# Altium project Passive_Sonar_Rev1.PrjPcb
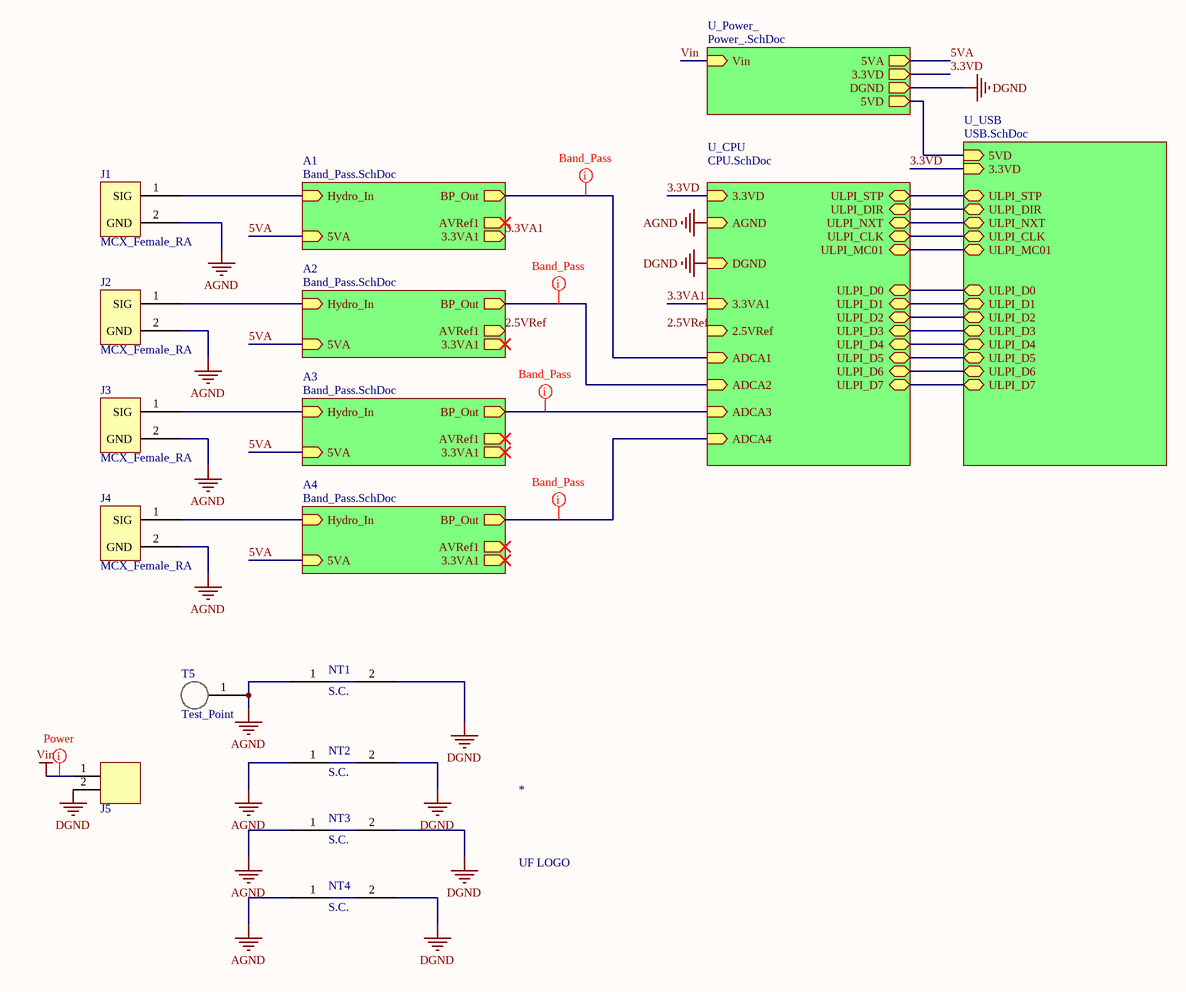
[diagram p0: Top_Level.SchDoc]
5 sheets, 222 parts. Net scope: hierarchical (ports join the sheet entries above them; power ports are global).
Board file: Passive_Sonar_Rev1.PcbDoc
Sheets:
  Top_Level.SchDoc
    A1 = Band_Pass.SchDoc
    A2 = Band_Pass.SchDoc
    A3 = Band_Pass.SchDoc
    A4 = Band_Pass.SchDoc
    U_Power_ = Power_.SchDoc
    U_CPU = CPU.SchDoc
    U_USB = USB.SchDoc

## Sheet Top_Level.SchDoc
size 381 x 381 mm

### Parts
*  UF LOGO  [UF LOGO-1000]
J1  MCX_Female_RA  [MCX_Female]
J2  MCX_Female_RA  [MCX_Female]
J3  MCX_Female_RA  [MCX_Female]
J4  MCX_Female_RA  [MCX_Female]
J5  2-pin Horz Sherlock  [MOLEX-HDR-1X2-SHERLOCK-HORZ]  (value not drawn)
MIL  MIL LOGO  [MIL LOGO - 500]  (value not drawn)
NT1  S.C.  [Net_Tie]
NT2  S.C.  [Net_Tie]
NT3  S.C.  [Net_Tie]
NT4  S.C.  [Net_Tie]
T5  Test_Point  [TP]

### Sub-sheets
A1 = Band_Pass.SchDoc: Hydro_In (in), BP_Out (out), 5VA (in), 3.3VA1 (out), AVRef1 (out)
A2 = Band_Pass.SchDoc: Hydro_In (in), BP_Out (out), 5VA (in), AVRef1 (out), 3.3VA1 (out)
A3 = Band_Pass.SchDoc: Hydro_In (in), BP_Out (out), 5VA (in), AVRef1 (out), 3.3VA1 (out)
A4 = Band_Pass.SchDoc: Hydro_In (in), BP_Out (out), 5VA (in), AVRef1 (out), 3.3VA1 (out)
U_CPU = CPU.SchDoc: 3.3VD (in), AGND (in), DGND (in), 3.3VA1 (in), 2.5VRef (in), ADCA1 (in), ADCA2 (in), ADCA3 (in), ADCA4 (in), ULPI_STP (bidir), ULPI_DIR (bidir), ULPI_NXT (bidir), ULPI_D0 (bidir), ULPI_D1 (bidir), ULPI_CLK (bidir), ULPI_D2 (bidir), ULPI_D3 (bidir), ULPI_D4 (bidir), ULPI_D5 (bidir), ULPI_D6 (bidir), ULPI_D7 (bidir), ULPI_MC01 (bidir)
U_Power_ = Power_.SchDoc: 5VA (out), Vin (in), 3.3VD (out), DGND (out), 5VD (out)
U_USB = USB.SchDoc: 5VD (in), 3.3VD (in), ULPI_STP (bidir), ULPI_DIR (bidir), ULPI_NXT (bidir), ULPI_D0 (bidir), ULPI_D1 (bidir), ULPI_CLK (bidir), ULPI_D2 (bidir), ULPI_D3 (bidir), ULPI_D4 (bidir), ULPI_D5 (bidir), ULPI_D6 (bidir), ULPI_MC01 (bidir), ULPI_D7 (bidir)

### Nets
3.3VA1: sheet A1/3.3VA1, sheet A2/3.3VA1, sheet A3/3.3VA1, sheet A4/3.3VA1, sheet U_CPU/3.3VA1
3.3VD: sheet U_Power_/3.3VD, sheet U_CPU/3.3VD, sheet U_USB/3.3VD
5VA: sheet A1/5VA, sheet A2/5VA, sheet A3/5VA, sheet A4/5VA, sheet U_Power_/5VA
5VD: sheet U_Power_/5VD, sheet U_USB/5VD
AGND: J1.2(GND) J2.2(GND) J3.2(GND) J4.2(GND) NT1.1 NT2.1 NT3.1 NT4.1 T5.1 ; sheet U_CPU/AGND
DGND: J5.2 NT1.2 NT2.2 NT3.2 NT4.2 ; sheet U_Power_/DGND, sheet U_CPU/DGND
Vin: J5.1 ; sheet U_Power_/Vin
Hydro1: J1.1(SIG) ; sheet A1/Hydro_In
Hydro1: J2.1(SIG) ; sheet A2/Hydro_In  [a separate net that carries the same name]
Hydro1: J3.1(SIG) ; sheet A3/Hydro_In  [a separate net that carries the same name]
Hydro1: J4.1(SIG) ; sheet A4/Hydro_In  [a separate net that carries the same name]
NetU2_A1_6: sheet A1/BP_Out, sheet U_CPU/ADCA1
NetU2_A2_6: sheet A2/BP_Out, sheet U_CPU/ADCA2
NetU2_A3_6: sheet A3/BP_Out, sheet U_CPU/ADCA3
NetU2_A4_6: sheet A4/BP_Out, sheet U_CPU/ADCA4
NetU8_26: sheet U_CPU/ULPI_STP, sheet U_USB/ULPI_STP
NetU8_28: sheet U_CPU/ULPI_DIR, sheet U_USB/ULPI_DIR
NetU8_29: sheet U_CPU/ULPI_NXT, sheet U_USB/ULPI_NXT
NetU8_37: sheet U_CPU/ULPI_D0, sheet U_USB/ULPI_D0
NetU8_41: sheet U_CPU/ULPI_CLK, sheet U_USB/ULPI_CLK
NetU8_46: sheet U_CPU/ULPI_D1, sheet U_USB/ULPI_D1
NetU8_47: sheet U_CPU/ULPI_D2, sheet U_USB/ULPI_D2
NetU8_69: sheet U_CPU/ULPI_D3, sheet U_USB/ULPI_D3
NetU8_70: sheet U_CPU/ULPI_D4, sheet U_USB/ULPI_D4
NetU8_73: sheet U_CPU/ULPI_D5, sheet U_USB/ULPI_D5
NetU8_74: sheet U_CPU/ULPI_D6, sheet U_USB/ULPI_D6
NetU8_100: sheet U_CPU/ULPI_MC01, sheet U_USB/ULPI_MC01
NetU8_135: sheet U_CPU/ULPI_D7, sheet U_USB/ULPI_D7

### Layout directives
net class Power: Vin
net class Band_Pass: NetU2_A1_6, NetU2_A2_6, NetU2_A3_6, NetU2_A4_6

### Notes on the sheet
- Labels drawn without touching a wire or pin: 2.5VRef

### Library data of the parts
J1-J4 = MCX_Female_RA: CONN MCX JACK R/A 50 OHM PCB; Supplier 1: Digi-Key; Supplier Part Number 1: A98546-ND
J5 = MOLEX-HDR-1x2-SHERLOCK_RA: Header, Molex, 2mm Pitch Sherlock Header, Single Row, Horizontal, 2 Circuits, Length 3.3mm,  0353630260; Manufacturer: Molex Inc; Manufacturer Part Number: 0353630260; Supplier Part Number 1: WM18931-ND; Supplier 1: Digi-Key
NT1-NT4 = Net_Tie
T5 = Test_Point: TEST POINT PC COMPACT .063"D; Supplier 1: Digi-Key; Supplier Part Number 1: 5006K-ND

## Sheet Band_Pass.SchDoc
size 381 x 254 mm
Used 4 times, as channels A1, A2, A3, A4. Parts and nets are listed once, with the designators drawn on the sheet.
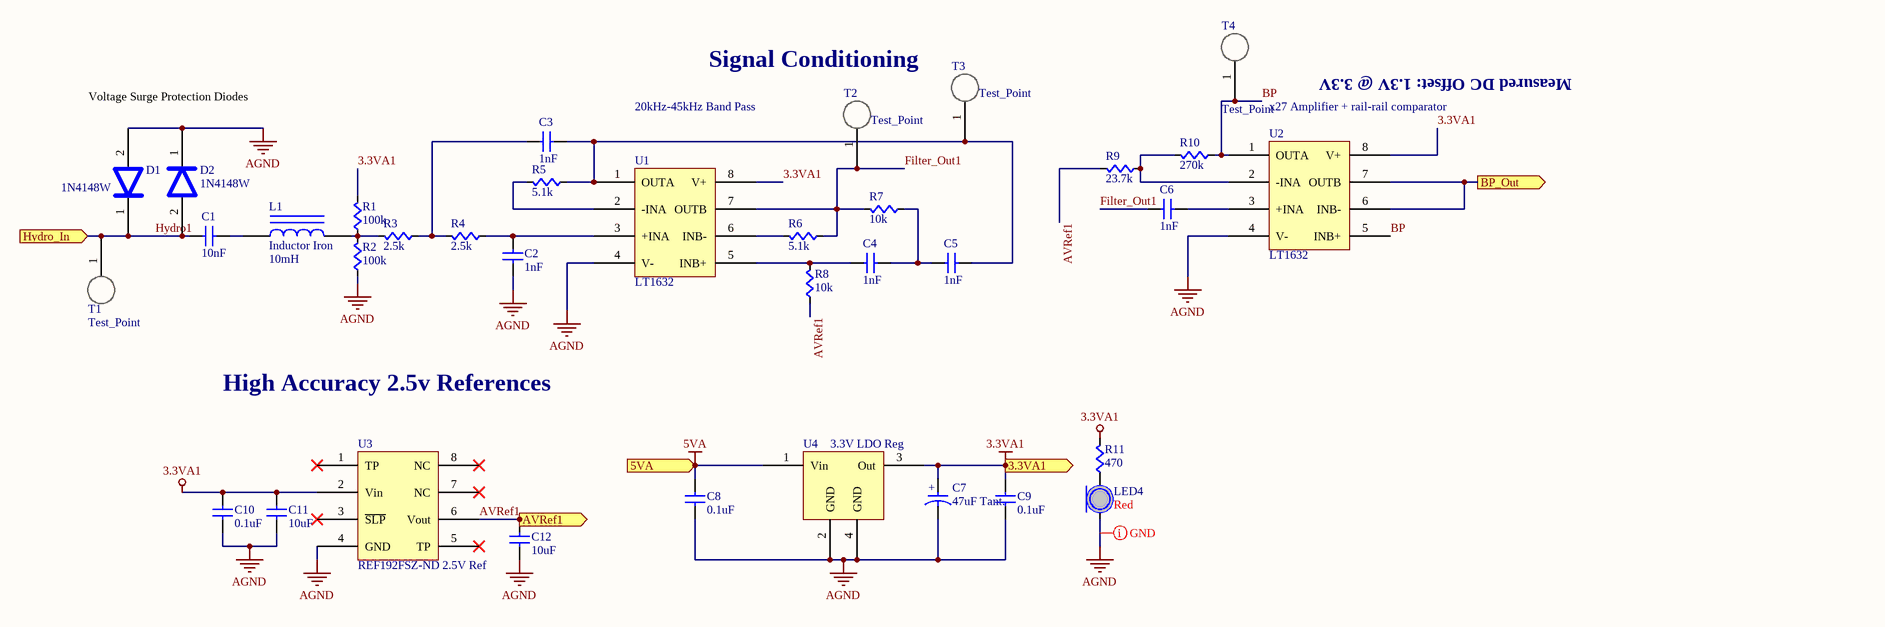
[diagram p1: Band_Pass.SchDoc]

### Parts
C1  value 10nF  [CAPC0603]  (hidden comment: Cap)
C2  value 1nF  [CAPC0603]  (hidden comment: Cap)
C3  value 1nF  [CAPC0603]  (hidden comment: Cap)
C4  value 1nF  [CAPC0603]  (hidden comment: Cap)
C5  value 1nF  [CAPC0603]  (hidden comment: Cap)
C6  value 1nF  [CAPC0603]  (hidden comment: Cap)
C7  value 47uF Tant.  [1206]  (hidden comment: Cap Tant)
C8  value 0.1uF  [CAPC0603]  (hidden comment: Cap)
C9  value 0.1uF  [CAPC0603]  (hidden comment: Cap)
C10  value 0.1uF  [CAPC0603]  (hidden comment: Cap)
C11  value 10uF  [CAPC0603]  (hidden comment: Cap)
C12  value 10uF  [CAPC0603]  (hidden comment: Cap)
D1  1N4148W  [SOD-123]
D2  1N4148W  [SOD-123]
L1  Inductor Iron  value 10mH  [Axial-11.7]
LED4  Color: Red  [LED0805]  (hidden comment: LED)
R1  value 100k  [RES0603]  (hidden comment: Res)
R2  value 100k  [RES0603]  (hidden comment: Res)
R3  value 2.5k  [RES0603]  (hidden comment: Res)
R4  value 2.5k  [RES0603]  (hidden comment: Res)
R5  value 5.1k  [RES0603]  (hidden comment: Res)
R6  value 5.1k  [RES0603]  (hidden comment: Res)
R7  value 10k  [RES0603]  (hidden comment: Res)
R8  value 10k  [RES0603]  (hidden comment: Res)
R9  value 23.7k  [RES0603]  (hidden comment: Res)
R10  value 270k  [RES0603]  (hidden comment: Res)
R11  value 470  [RES0603]  (hidden comment: Res)
T1  Test_Point  [TP]
T2  Test_Point  [TP]
T3  Test_Point  [TP]
T4  Test_Point  [TP]
U1  LT1632  [SOIC127P600-8N]
U2  LT1632  [SOIC127P600-8N]
U3  REF192FSZ-ND 2.5V Ref  [SOIC2.5-8n]
U4  3.3V LDO Reg  [SOT23-4n]

### Ports
3.3VA1 (out), 5VA (in), AVRef1 (out), BP_Out (out), Hydro_In (in)

### Nets
3.3VA1: C7.1(A) C9.1(A) C10.1(A) C11.1(A) R1.1(A) R11.1(A) U1.8(V+) U2.8(V+) U3.2(Vin) U4.3(Out) ; port 3.3VA1
5VA: C8.1(A) U4.1(Vin) ; port 5VA
AGND: C2.2(B) C7.2(B) C8.2(B) C9.2(B) C10.2(B) C11.2(B) C12.2(B) D1.2 D2.1 LED4.C R2.2(B) U1.4(V-) U2.4(V-) U3.4(GND) U4.2(GND) U4.4(GND)
AVRef1: C12.1(A) R8.2(B) R9.1(A) U3.6(Vout) ; port AVRef1
BP: R10.2(B) T4.1 U2.1(OUTA) U2.5(INB+)
BP_Out: U2.6(INB-) U2.7(OUTB) ; port BP_Out
Filter_Out1: C6.1(A) R6.2(B) R7.1(A) T2.1 U1.7(OUTB)
Hydro1: C1.1(A) D1.1 D2.2 T1.1 ; port Hydro_In
NetC1_2: C1.2(B) L1.1
NetC2_1: C2.1(A) R4.2(B) U1.3(+INA)
NetC3_1: C3.1(A) R3.2(B) R4.1(A)
NetC3_2: C3.2(B) C5.2(B) R5.2(B) T3.1 U1.1(OUTA)
NetC4_1: C4.1(A) R8.1(A) U1.5(INB+)
NetC4_2: C4.2(B) C5.1(A) R7.2(B)
NetC6_2: C6.2(B) U2.3(+INA)
NetL1_2: L1.2 R1.2(B) R2.1(A) R3.1(A)
NetLED4_A: LED4.A R11.2(B)
NetR5_1: R5.1(A) U1.2(-INA)
NetR6_1: R6.1(A) U1.6(INB-)
NetR9_2: R9.2(B) R10.1(A) U2.2(-INA)

Not connected (* = marked no-connect by the designer): U3 1(TP)* 3(~{SLP})* 5(TP)* 7(NC)* 8(NC)*

### Channels
A1: designators end in _A1; ports 3.3VA1=3.3VA1 5VA=5VA AVRef1=AVRef1_A1 BP_Out=NetU2_A1_6 Hydro_In=Hydro1
A2: designators end in _A2; ports 3.3VA1=3.3VA1 5VA=5VA AVRef1=2.5VRef BP_Out=NetU2_A2_6 Hydro_In=Hydro1
A3: designators end in _A3; ports 3.3VA1=3.3VA1 5VA=5VA AVRef1=AVRef1_A3 BP_Out=NetU2_A3_6 Hydro_In=Hydro1
A4: designators end in _A4; ports 3.3VA1=3.3VA1 5VA=5VA AVRef1=AVRef1_A4 BP_Out=NetU2_A4_6 Hydro_In=Hydro1

### Layout directives
net class Ground: AGND

### Notes on the sheet
- Voltage Surge Protection Diodes
- 20kHz-45kHz Band Pass
- Signal Conditioning
- x27 Amplifier + rail-rail comparator
- Measured DC Offset: 1.3V @ 3.3V
- High Accuracy 2.5v References
- (in symbol CapPol) +

### Library data of the parts
C7 = CapPol: CAP TANT 47UF 10V 10% 1411; Supplier 1: Digi-Key; Supplier Part Number 1: 399-9728-1-ND
D1 D2 = 1N4148W: DIODE GEN PURP 75V 150MA SOD123; Supplier 1: Digi-Key; Supplier Part Number 1: 1N4148W-E3-08CT-ND
L1 = Inductor Iron: Magnetic-Core Inductor; Published: 24-Mar-1999; LatestRevisionDate: 17-Jul-2002; LatestRevisionNote: Re-released for DXP Platform.; PackageReference: AXIAL-0.9; Publisher: Altium Limited; PackageDescription: Axial Device, Thru-Hole; 2 Leads; 0.9 in Pin Spacing; Supplier 1: Digi-Key; Supplier Part Number 1: RLB0812-103KL-ND
T1-T4 = Test_Point: TEST POINT PC COMPACT .063"D; Supplier 1: Digi-Key; Supplier Part Number 1: 5006K-ND
U1 U2 = LT1632: IC OPAMP GP 45MHZ RRO 8SO; Supplier 1: Digi-Key; Supplier Part Number 1: LT1632CS8#PBF-ND
U3 = Ref2.5V: IC VREF SERIES 2.5V 8SOIC; Supplier 1: Digi-Key; Supplier Part Number 1: REF192FSZ-ND
U4 = LM3940IMPX-3.3: IC REG LDO 3.3V 1A SOT223; Supplier 1: Digi-Key; Supplier Part Number 1: LM3940IMPX-3.3/NOPBCT-ND
C1-C6 C8-C12 = Cap: Supplier 1: Digi-Key; Supplier Part Number 1: 1276-1000-1-ND
LED4 = LED: Supplier 1: Digi-Key; Supplier Part Number 1: 754-1122-1-ND
R1-R11 = Res: Supplier 1: Digi-Key; Supplier Part Number 1: RMCF0603JT10K0CT-ND

## Sheet Power_.SchDoc
size 381 x 241 mm
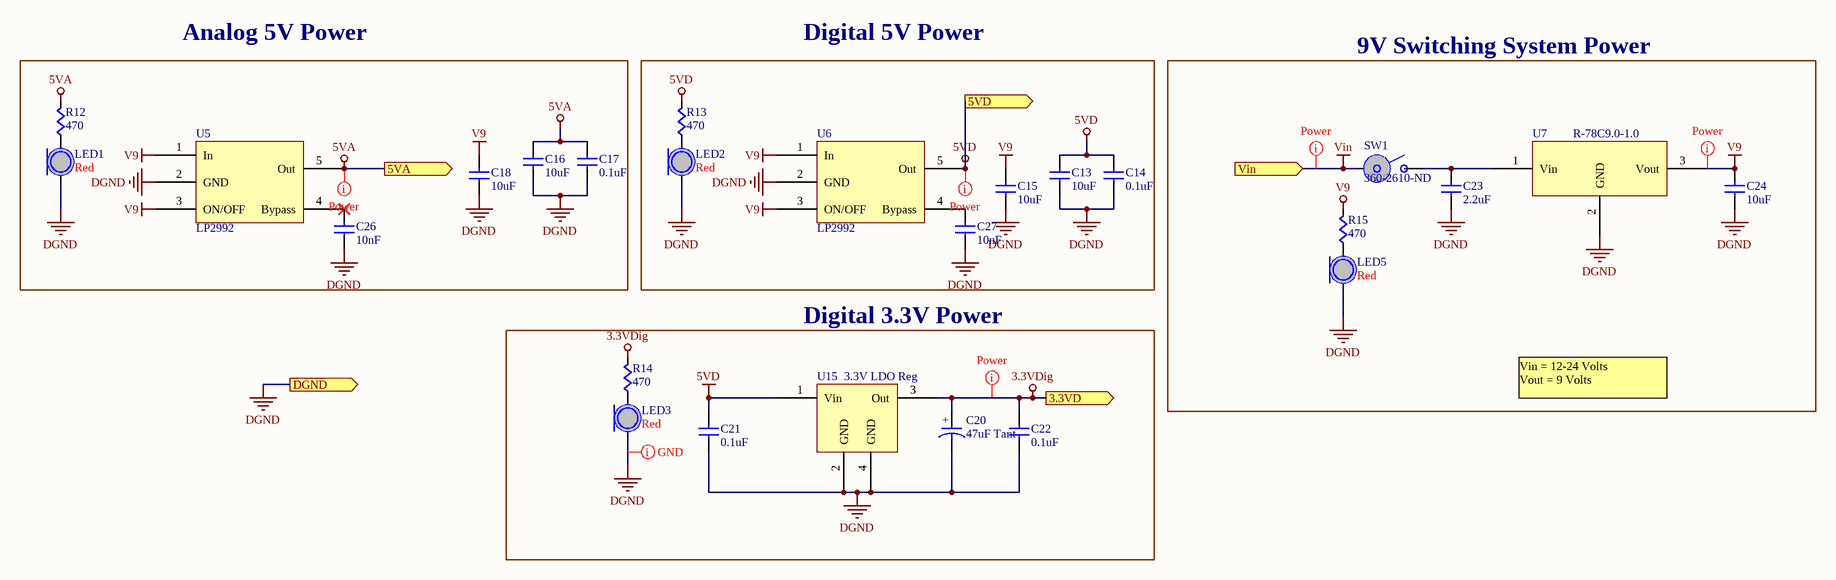
[diagram p2: Power_.SchDoc]

### Parts
C13  value 10uF  [CAPC0603]  (hidden comment: Cap)
C14  value 0.1uF  [CAPC0603]  (hidden comment: Cap)
C15  value 10uF  [CAPC0603]  (hidden comment: Cap)
C16  value 10uF  [CAPC0603]  (hidden comment: Cap)
C17  value 0.1uF  [CAPC0603]  (hidden comment: Cap)
C18  value 10uF  [CAPC0603]  (hidden comment: Cap)
C20  value 47uF Tant  [1206]  (hidden comment: Cap Tant)
C21  value 0.1uF  [CAPC0603]  (hidden comment: Cap)
C22  value 0.1uF  [CAPC0603]  (hidden comment: Cap)
C23  value 2.2uF  [CAPC0603]  (hidden comment: Cap)
C24  value 10uF  [CAPC0603]  (hidden comment: Cap)
C26  value 10nF  [CAPC0603]  (hidden comment: Cap)
C27  value 10nF  [CAPC0603]  (hidden comment: Cap)
LED1  Color: Red  [LED0805]  (hidden comment: LED)
LED2  Color: Red  [LED0805]  (hidden comment: LED)
LED3  Color: Red  [LED0805]  (hidden comment: LED)
LED5  Color: Red  [LED0805]  (hidden comment: LED)
R12  value 470  [RES0603]  (hidden comment: Res)
R13  value 470  [RES0603]  (hidden comment: Res)
R14  value 470  [RES0603]  (hidden comment: Res)
R15  value 470  [RES0603]  (hidden comment: Res)
SW1  360-2610-ND  [AS11CP]
U5  LP2992  [SOT23-5]
U6  LP2992  [SOT23-5]
U7  R-78C9.0-1.0  [R-78C12-1.0]
U15  3.3V LDO Reg  [SOT23-4n]

### Blocks framed on the sheet
Analog 5V Power: C16-C18 C26 LED1 R12 U5
Digital 5V Power: C13-C15 C27 LED2 R13 U6
9V Switching System Power: C23 C24 LED5 R15 SW1 U7
Digital 3.3V Power: C20-C22 LED3 R14 U15

### Ports
3.3VD (out), 5VA (out), 5VD (out), DGND (out), Vin (in)

### Nets
3.3VDig: C20.1(A) C22.1(A) R14.1(A) U15.3(Out) ; port 3.3VD  [project net 3.3VD]
5VA: C16.1(A) C17.1(A) R12.1(A) U5.5(Out) ; port 5VA
5VD: C13.1(A) C14.1(A) C21.1(A) R13.1(A) U6.5(Out) U15.1(Vin) ; port 5VD
DGND: C13.2(B) C14.2(B) C15.2(B) C16.2(B) C17.2(B) C18.2(B) C20.2(B) C21.2(B) C22.2(B) C23.2(B) C24.2(B) C26.2(B) C27.2(B) LED1.C LED2.C LED3.C LED5.C U5.2(GND) U6.2(GND) U7.2(GND) U15.2(GND) U15.4(GND) ; port DGND
V9: C15.1(A) C18.1(A) C24.1(A) R15.1(A) U5.1(In) U5.3(ON/OFF) U6.1(In) U6.3(ON/OFF) U7.3(Vout)
Vin: SW1.1(A) ; port Vin
NetC23_1: C23.1(A) SW1.2(B) U7.1(Vin)
NetC26_1: C26.1(A) U5.4(Bypass)
NetC27_1: C27.1(A) U6.4(Bypass)
NetLED1_A: LED1.A R12.2(B)
NetLED2_A: LED2.A R13.2(B)
NetLED3_A: LED3.A R14.2(B)
NetLED5_A: LED5.A R15.2(B)

### Layout directives
net class Power: 3.3VD, 5VA, 5VD, V9, Vin
net class Ground: DGND

### Notes on the sheet
- Vin = 12-24 Volts
  Vout = 9 Volts
- (in symbol CapPol) +

### Library data of the parts
C20 = CapPol: CAP TANT 47UF 10V 10% 1411; Supplier 1: Digi-Key; Supplier Part Number 1: 399-9728-1-ND
SW1 = AS11CP: SWITCH SLIDE SPST 0.4VA 28V; Supplier 1: Digi-Key; Supplier Part Number 1: 360-2610-ND
U5 U6 = LP2992: IC REG LDO 5V 0.25A SOT23-5; Supplier 1: Digi-Key; Supplier Part Number 1: LP2992IM5-5.0/NOPBCT-ND
U7 = R-78C9-1.0: 945-1396-5-ND; Supplier 1: Digi-Key; Supplier Part Number 1: 945-1396-5-ND
U15 = LM3940IMPX-3.3: IC REG LDO 3.3V 1A SOT223; Supplier 1: Digi-Key; Supplier Part Number 1: LM3940IMPX-3.3/NOPBCT-ND
C13-C18 C21-C24 C26 C27 = Cap: Supplier 1: Digi-Key; Supplier Part Number 1: 1276-1000-1-ND
LED1-LED3 LED5 = LED: Supplier 1: Digi-Key; Supplier Part Number 1: 754-1122-1-ND
R12-R15 = Res: Supplier 1: Digi-Key; Supplier Part Number 1: RMCF0603JT10K0CT-ND

## Sheet CPU.SchDoc
size 381 x 381 mm
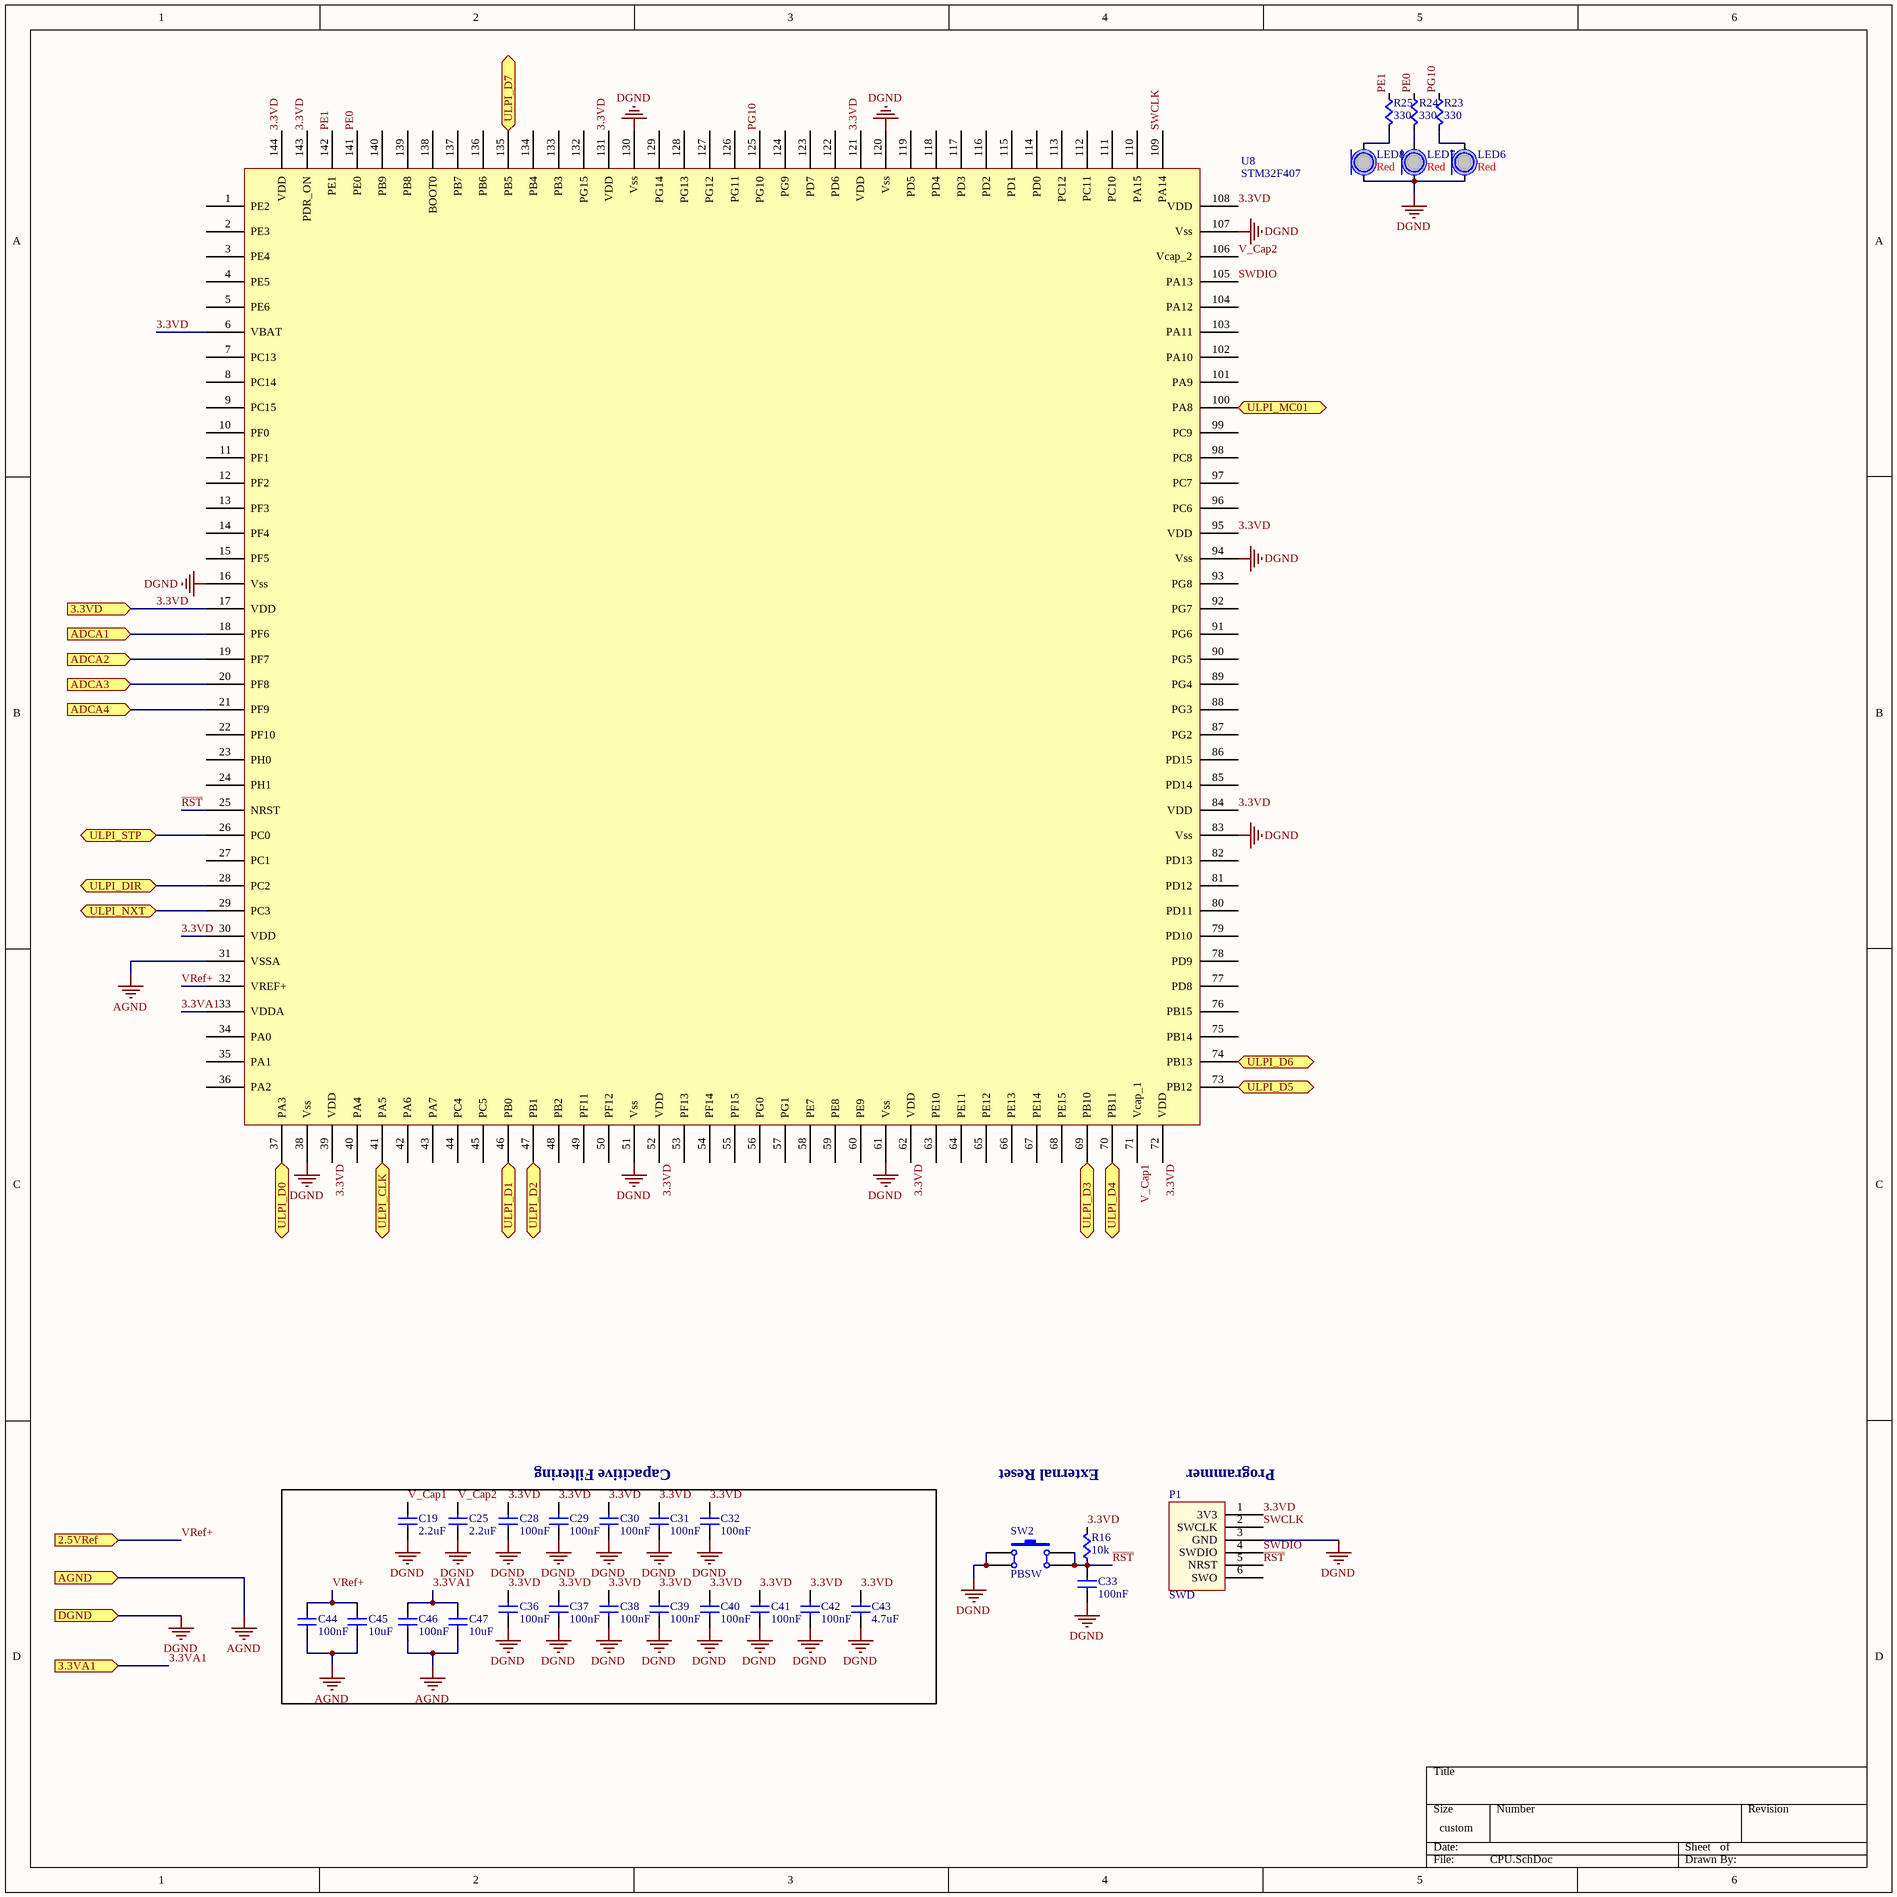
[diagram p3: CPU.SchDoc]

### Parts
C19  value 2.2uF  [CAPC0603]  (hidden comment: Cap)
C25  value 2.2uF  [CAPC0603]  (hidden comment: Cap)
C28  value 100nF  [CAPC0603]  (hidden comment: Cap)
C29  value 100nF  [CAPC0603]  (hidden comment: Cap)
C30  value 100nF  [CAPC0603]  (hidden comment: Cap)
C31  value 100nF  [CAPC0603]  (hidden comment: Cap)
C32  value 100nF  [CAPC0603]  (hidden comment: Cap)
C33  value 100nF  [CAPC0603]  (hidden comment: Cap)
C36  value 100nF  [CAPC0603]  (hidden comment: Cap)
C37  value 100nF  [CAPC0603]  (hidden comment: Cap)
C38  value 100nF  [CAPC0603]  (hidden comment: Cap)
C39  value 100nF  [CAPC0603]  (hidden comment: Cap)
C40  value 100nF  [CAPC0603]  (hidden comment: Cap)
C41  value 100nF  [CAPC0603]  (hidden comment: Cap)
C42  value 100nF  [CAPC0603]  (hidden comment: Cap)
C43  value 4.7uF  [CAPC0603]  (hidden comment: Cap)
C44  value 100nF  [CAPC0603]  (hidden comment: Cap)
C45  value 10uF  [CAPC0603]  (hidden comment: Cap)
C46  value 100nF  [CAPC0603]  (hidden comment: Cap)
C47  value 10uF  [CAPC0603]  (hidden comment: Cap)
LED6  Color: Red  [LED0603]  (hidden comment: LED)
LED7  Color: Red  [LED0603]  (hidden comment: LED)
LED8  Color: Red  [LED0603]  (hidden comment: LED)
P1  SWD  [SWD_STM32]
R16  value 10k  [RES0603]  (hidden comment: Res)
R23  value 330  [RES0603]  (hidden comment: Res)
R24  value 330  [RES0603]  (hidden comment: Res)
R25  value 330  [RES0603]  (hidden comment: Res)
SW2  PBSW  [PBSW]
U8  STM32F407  [LQFP-144]

### Ports
2.5VRef (in), 3.3VA1 (in), 3.3VD (in), ADCA1 (in), ADCA2 (in), ADCA3 (in), ADCA4 (in), AGND (in), DGND (in), ULPI_CLK (bidir), ULPI_D0 (bidir), ULPI_D1 (bidir), ULPI_D2 (bidir), ULPI_D3 (bidir), ULPI_D4 (bidir), ULPI_D5 (bidir), ULPI_D6 (bidir), ULPI_D7 (bidir), ULPI_DIR (bidir), ULPI_MC01 (bidir), ULPI_NXT (bidir), ULPI_STP (bidir)

### Nets
1: SW2.2(A')
3: SW2.4(B')
3.3VA1: C46.1(A) C47.1(A) U8.33(VDDA) ; port 3.3VA1
3.3VD: C28.1(A) C29.1(A) C30.1(A) C31.1(A) C32.1(A) C36.1(A) C37.1(A) C38.1(A) C39.1(A) C40.1(A) C41.1(A) C42.1(A) C43.1(A) P1.1(3V3) R16.1(A) U8.6(VBAT) U8.17(VDD) U8.30(VDD) U8.39(VDD) U8.52(VDD) U8.62(VDD) U8.72(VDD) U8.84(VDD) U8.95(VDD) U8.108(VDD) U8.121(VDD) U8.131(VDD) U8.143(PDR_ON) U8.144(VDD) ; port 3.3VD
AGND: C44.2(B) C45.2(B) C46.2(B) C47.2(B) U8.31(VSSA) ; port AGND
DGND: C19.2(B) C25.2(B) C28.2(B) C29.2(B) C30.2(B) C31.2(B) C32.2(B) C33.2(B) C36.2(B) C37.2(B) C38.2(B) C39.2(B) C40.2(B) C41.2(B) C42.2(B) C43.2(B) LED6.C LED7.C LED8.C P1.3(GND) SW2.1(A) SW2.2(A') U8.16(Vss) U8.38(Vss) U8.51(Vss) U8.61(Vss) U8.83(Vss) U8.94(Vss) U8.107(Vss) U8.120(Vss) U8.130(Vss) ; port DGND
PE0: R24.2(B) U8.141(PE0)
PE1: R25.2(B) U8.142(PE1)
PG10: R23.2(B) U8.125(PG10)
~{RST}: C33.1(A) P1.5(NRST) R16.2(B) SW2.3(B) SW2.4(B') U8.25(NRST)
SWCLK: P1.2(SWCLK) U8.109(PA14)
SWDIO: P1.4(SWDIO) U8.105(PA13)
V_Cap1: C19.1(A) U8.71(Vcap_1)
V_Cap2: C25.1(A) U8.106(Vcap_2)
VRef+: C44.1(A) C45.1(A) U8.32(VREF+) ; port 2.5VRef
NetLED6_A: LED6.A R23.1(A)
NetLED7_A: LED7.A R24.1(A)
NetLED8_A: LED8.A R25.1(A)
NetU2_A1_6: U8.18(PF6) ; port ADCA1
NetU2_A2_6: U8.19(PF7) ; port ADCA2
NetU2_A3_6: U8.20(PF8) ; port ADCA3
NetU2_A4_6: U8.21(PF9) ; port ADCA4
NetU8_26: U8.26(PC0) ; port ULPI_STP
NetU8_28: U8.28(PC2) ; port ULPI_DIR
NetU8_29: U8.29(PC3) ; port ULPI_NXT
NetU8_37: U8.37(PA3) ; port ULPI_D0
NetU8_41: U8.41(PA5) ; port ULPI_CLK
NetU8_46: U8.46(PB0) ; port ULPI_D1
NetU8_47: U8.47(PB1) ; port ULPI_D2
NetU8_69: U8.69(PB10) ; port ULPI_D3
NetU8_70: U8.70(PB11) ; port ULPI_D4
NetU8_73: U8.73(PB12) ; port ULPI_D5
NetU8_74: U8.74(PB13) ; port ULPI_D6
NetU8_100: U8.100(PA8) ; port ULPI_MC01
NetU8_135: U8.135(PB5) ; port ULPI_D7

Not connected (* = marked no-connect by the designer): P1 6(SWO); U8 1(PE2) 2(PE3) 3(PE4) 4(PE5) 5(PE6) 7(PC13) 8(PC14) 9(PC15) 10(PF0) 11(PF1) 12(PF2) 13(PF3) 14(PF4) 15(PF5) 22(PF10) 23(PH0) 24(PH1) 27(PC1) 34(PA0) 35(PA1) 36(PA2) 40(PA4) 42(PA6) 43(PA7) 44(PC4) 45(PC5) 48(PB2) 49(PF11) 50(PF12) 53(PF13) 54(PF14) 55(PF15) 56(PG0) 57(PG1) 58(PE7) 59(PE8) 60(PE9) 63(PE10) 64(PE11) 65(PE12) 66(PE13) 67(PE14) 68(PE15) 75(PB14) 76(PB15) 77(PD8) 78(PD9) 79(PD10) 80(PD11) 81(PD12) 82(PD13) 85(PD14) 86(PD15) 87(PG2) 88(PG3) 89(PG4) 90(PG5) 91(PG6) 92(PG7) 93(PG8) 96(PC6) 97(PC7) 98(PC8) 99(PC9) 101(PA9) 102(PA10) 103(PA11) 104(PA12) 110(PA15) 111(PC10) 112(PC11) 113(PC12) 114(PD0) 115(PD1) 116(PD2) 117(PD3) 118(PD4) 119(PD5) 122(PD6) 123(PD7) 124(PG9) 126(PG11) 127(PG12) 128(PG13) 129(PG14) 132(PG15) 133(PB3) 134(PB4) 136(PB6) 137(PB7) 138(BOOT0) 139(PB8) 140(PB9)

### Notes on the sheet
- Capacitive Filtering
- External Reset
- (near P1) Programmer

### Library data of the parts
P1 = SWD_STM32: SWD connector matching the pinout on STM Discovery Boards
SW2 = SW-PB: Push Button Switch; Manufacturer: Panasonic Electronic Components; Manufacturer Part Number: EVQ-9P105M; Outline: 6.10mm x 6.00mm; Actuator Orientation: Top Actuated; Actuator Height off PCB, from Pins: 5.00mm; Published: 24-Mar-1999; LatestRevisionDate: 17-Jul-2002; LatestRevisionNote: Re-released for DXP Platform.; PackageReference: SPST-2; Publisher: Altium Limited; PackageDescription: Switch; 2 Leads; Supplier 1: Digi-Key; Supplier Part Number 1: P13586SCT-ND
U8 = STM32F407ZGT6: IC MCU 32BIT 1MB FLASH 144LQFP; Supplier 1: Digi-Key; Supplier Part Number 1: 497-11766-ND
C19 C25 C28-C33 C36-C47 = Cap: Supplier 1: Digi-Key; Supplier Part Number 1: 1276-1000-1-ND
LED6-LED8 = LED: Supplier 1: Digi-Key; Supplier Part Number 1: 754-1122-1-ND
R16 R23-R25 = Res: Supplier 1: Digi-Key; Supplier Part Number 1: RMCF0603JT10K0CT-ND

## Sheet USB.SchDoc
size A
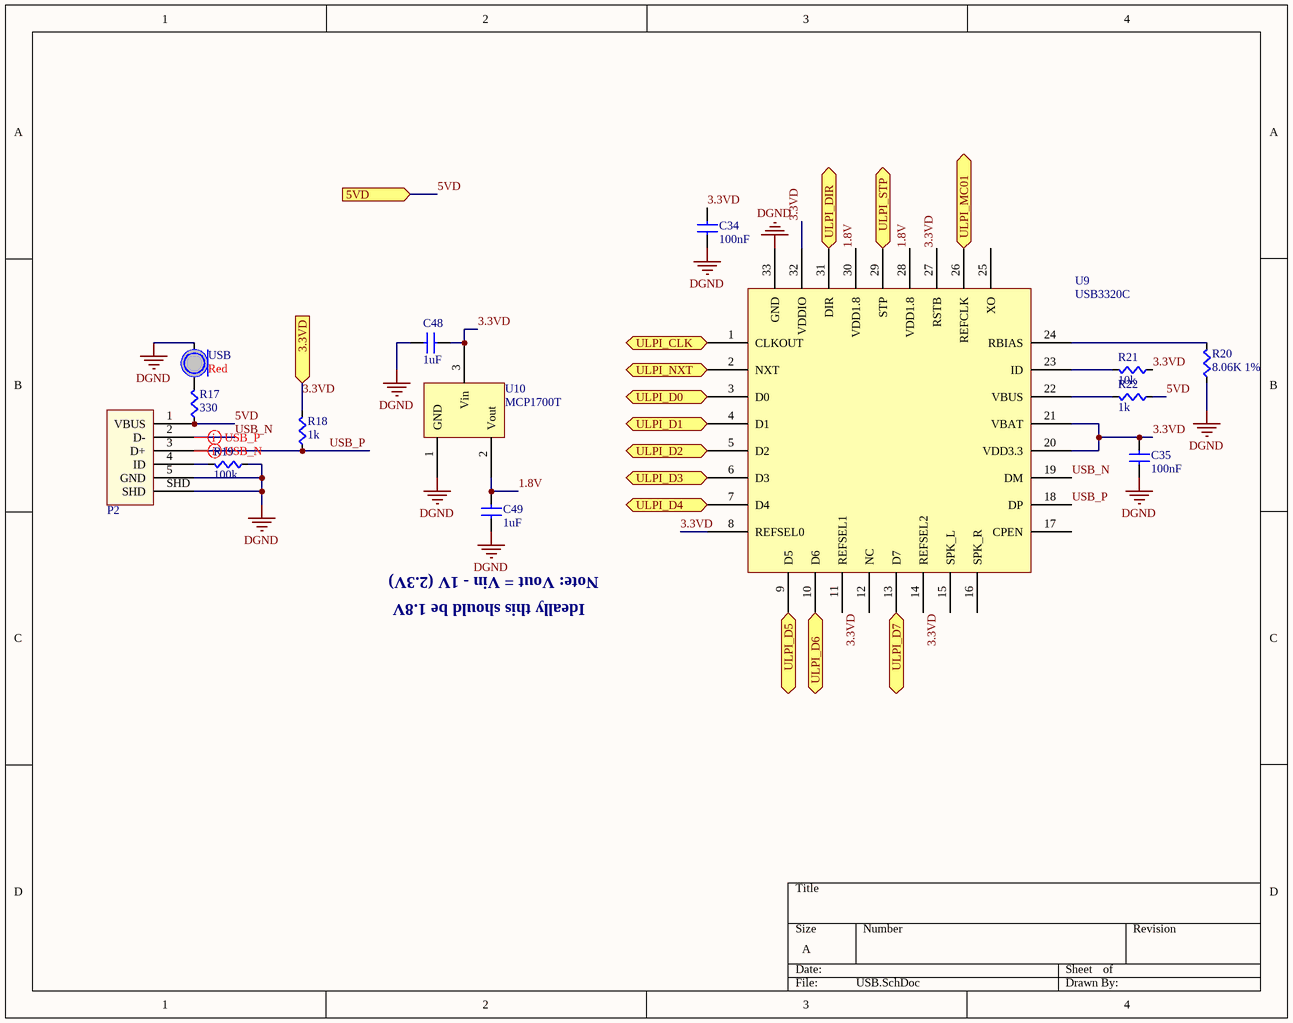
[diagram p4: USB.SchDoc]

### Parts
C34  value 100nF  [CAPC0603]  (hidden comment: Cap)
C35  value 100nF  [CAPC0603]  (hidden comment: Cap)
C48  value 1uF  [CAPC0603]  (hidden comment: Cap)
C49  value 1uF  [CAPC0603]  (hidden comment: Cap)
P2  USB Micro  [10118192-0001LF]  (value not drawn)
R17  value 330  [RES0603]  (hidden comment: Res)
R18  value 1k  [RES0603]  (hidden comment: Res)
R19  value 100k  [RES0603]  (hidden comment: Res)
R20  value 8.06K 1%  [RES0603]  (hidden comment: Res)
R21  value 10k  [RES0603]  (hidden comment: Res)
R22  value 1k  [RES0603]  (hidden comment: Res)
U9  USB3320C  [QFN-32]
U10  MCP1700T  [SOT23-3]
USB  Color: Red  [LED0805]  (hidden comment: LED)

### Ports
3.3VD (in), 5VD (in), ULPI_CLK (bidir), ULPI_D0 (bidir), ULPI_D1 (bidir), ULPI_D2 (bidir), ULPI_D3 (bidir), ULPI_D4 (bidir), ULPI_D5 (bidir), ULPI_D6 (bidir), ULPI_D7 (bidir), ULPI_DIR (bidir), ULPI_MC01 (bidir), ULPI_NXT (bidir), ULPI_STP (bidir)

### Nets
3.3VD: C34.1(A) C35.1(A) C48.1(A) R18.1(A) R21.2(B) U9.8(REFSEL0) U9.11(REFSEL1) U9.14(REFSEL2) U9.20(VDD3.3) U9.21(VBAT) U9.27(RSTB) U9.32(VDDIO) U10.3(Vin) ; port 3.3VD
5VD: P2.1(VBUS) R17.2(B) R22.2(B) ; port 5VD
DGND: C34.2(B) C35.2(B) C48.2(B) C49.2(B) P2.5(GND) P2.SHD R19.2(B) R20.2(B) U9.33(GND) U10.1(GND) USB.C
1.8V: C49.1(A) U9.28(VDD1.8) U9.30(VDD1.8) U10.2(Vout)
USB_N: P2.2(D-) U9.19(DM)
USB_P: P2.3(D+) R18.2(B) U9.18(DP)
NetP2_4: P2.4(ID) R19.1(A)
NetR17_1: R17.1(A) USB.A
NetR20_1: R20.1(A) U9.24(RBIAS)
NetR21_1: R21.1(A) U9.23(ID)
NetR22_1: R22.1(A) U9.22(VBUS)
NetU8_26: U9.29(STP) ; port ULPI_STP
NetU8_28: U9.31(DIR) ; port ULPI_DIR
NetU8_29: U9.2(NXT) ; port ULPI_NXT
NetU8_37: U9.3(D0) ; port ULPI_D0
NetU8_41: U9.1(CLKOUT) ; port ULPI_CLK
NetU8_46: U9.4(D1) ; port ULPI_D1
NetU8_47: U9.5(D2) ; port ULPI_D2
NetU8_69: U9.6(D3) ; port ULPI_D3
NetU8_70: U9.7(D4) ; port ULPI_D4
NetU8_73: U9.9(D5) ; port ULPI_D5
NetU8_74: U9.10(D6) ; port ULPI_D6
NetU8_100: U9.26(REFCLK) ; port ULPI_MC01
NetU8_135: U9.13(D7) ; port ULPI_D7

Not connected (* = marked no-connect by the designer): U9 12(NC) 15(SPK_L) 16(SPK_R) 17(CPEN) 25(XO)

### Layout directives
differential pair: USB_N, USB_P

### Notes on the sheet
- Note: Vout = Vin - 1V (2.3V)
- Ideally this should be 1.8V

### Library data of the parts
P2 = USB Micro: USB Mini B Metal Shield SMT; Supplier 1: Digi-Key; Supplier Part Number 1: 609-4613-1-ND
U9 = USB3320C: MULTI-FREQ USB 2.0 ULPI PHY; Supplier Part Number 1: USB3320C-EZK-ND; Supplier 1: Digi-Key
U10 = LDO 1.8V: IC REG LDO 1.8V 0.2A SOT23-3; Supplier 1: Digi-Key; Supplier Part Number 1: MCP1700T1802ETTCT-ND
C34 C35 C48 C49 = Cap: Supplier 1: Digi-Key; Supplier Part Number 1: 1276-1000-1-ND
R17-R22 = Res: Supplier 1: Digi-Key; Supplier Part Number 1: RMCF0603JT10K0CT-ND
USB = LED: Supplier 1: Digi-Key; Supplier Part Number 1: 754-1122-1-ND

## Nets that join several sheets
3.3VA1: A1 (10 pins), A2 (10 pins), A3 (10 pins), A4 (10 pins), CPU (C46.1 C47.1 U8.33)
3.3VD: Power_ (C20.1 C22.1 R14.1 U15.3), CPU (29 pins), USB (13 pins)
5VA: A1 (C8_A1.1 U4_A1.1), A2 (C8_A2.1 U4_A2.1), A3 (C8_A3.1 U4_A3.1), A4 (C8_A4.1 U4_A4.1), Power_ (C16.1 C17.1 R12.1 U5.5)
5VD: Power_ (6 pins), USB (P2.1 R17.2 R22.2)
AGND: Top_Level (9 pins), A1 (16 pins), A2 (16 pins), A3 (16 pins), A4 (16 pins), CPU (5 pins)
DGND: Top_Level (5 pins), Power_ (22 pins), CPU (31 pins), USB (11 pins)
Vin: Top_Level (J5.1), Power_ (SW1.1)
Hydro1: Top_Level (J1.1), A1 (C1_A1.1 D1_A1.1 D2_A1.2 T1_A1.1)
Hydro1: Top_Level (J2.1), A2 (C1_A2.1 D1_A2.1 D2_A2.2 T1_A2.1)
Hydro1: Top_Level (J3.1), A3 (C1_A3.1 D1_A3.1 D2_A3.2 T1_A3.1)
Hydro1: Top_Level (J4.1), A4 (C1_A4.1 D1_A4.1 D2_A4.2 T1_A4.1)
NetU2_A1_6: A1 (U2_A1.6 U2_A1.7), CPU (U8.18)
NetU2_A2_6: A2 (U2_A2.6 U2_A2.7), CPU (U8.19)
NetU2_A3_6: A3 (U2_A3.6 U2_A3.7), CPU (U8.20)
NetU2_A4_6: A4 (U2_A4.6 U2_A4.7), CPU (U8.21)
NetU8_26: CPU (U8.26), USB (U9.29)
NetU8_28: CPU (U8.28), USB (U9.31)
NetU8_29: CPU (U8.29), USB (U9.2)
NetU8_37: CPU (U8.37), USB (U9.3)
NetU8_41: CPU (U8.41), USB (U9.1)
NetU8_46: CPU (U8.46), USB (U9.4)
NetU8_47: CPU (U8.47), USB (U9.5)
NetU8_69: CPU (U8.69), USB (U9.6)
NetU8_70: CPU (U8.70), USB (U9.7)
NetU8_73: CPU (U8.73), USB (U9.9)
NetU8_74: CPU (U8.74), USB (U9.10)
NetU8_100: CPU (U8.100), USB (U9.26)
NetU8_135: CPU (U8.135), USB (U9.13)